# Altium project Cellar Watchdog.PrjPcb (part 3 of 4)

## Sheet Battery Charger.SchDoc: Battery Charger & Port
size A4; Date: Dec. 27th, 2022; Author: Karl Asseily; DrawnBy: Karl Asseily; DocumentNumber: 202301151822; Revision: 1.2; SheetNumber: 7; SheetTotal: 20
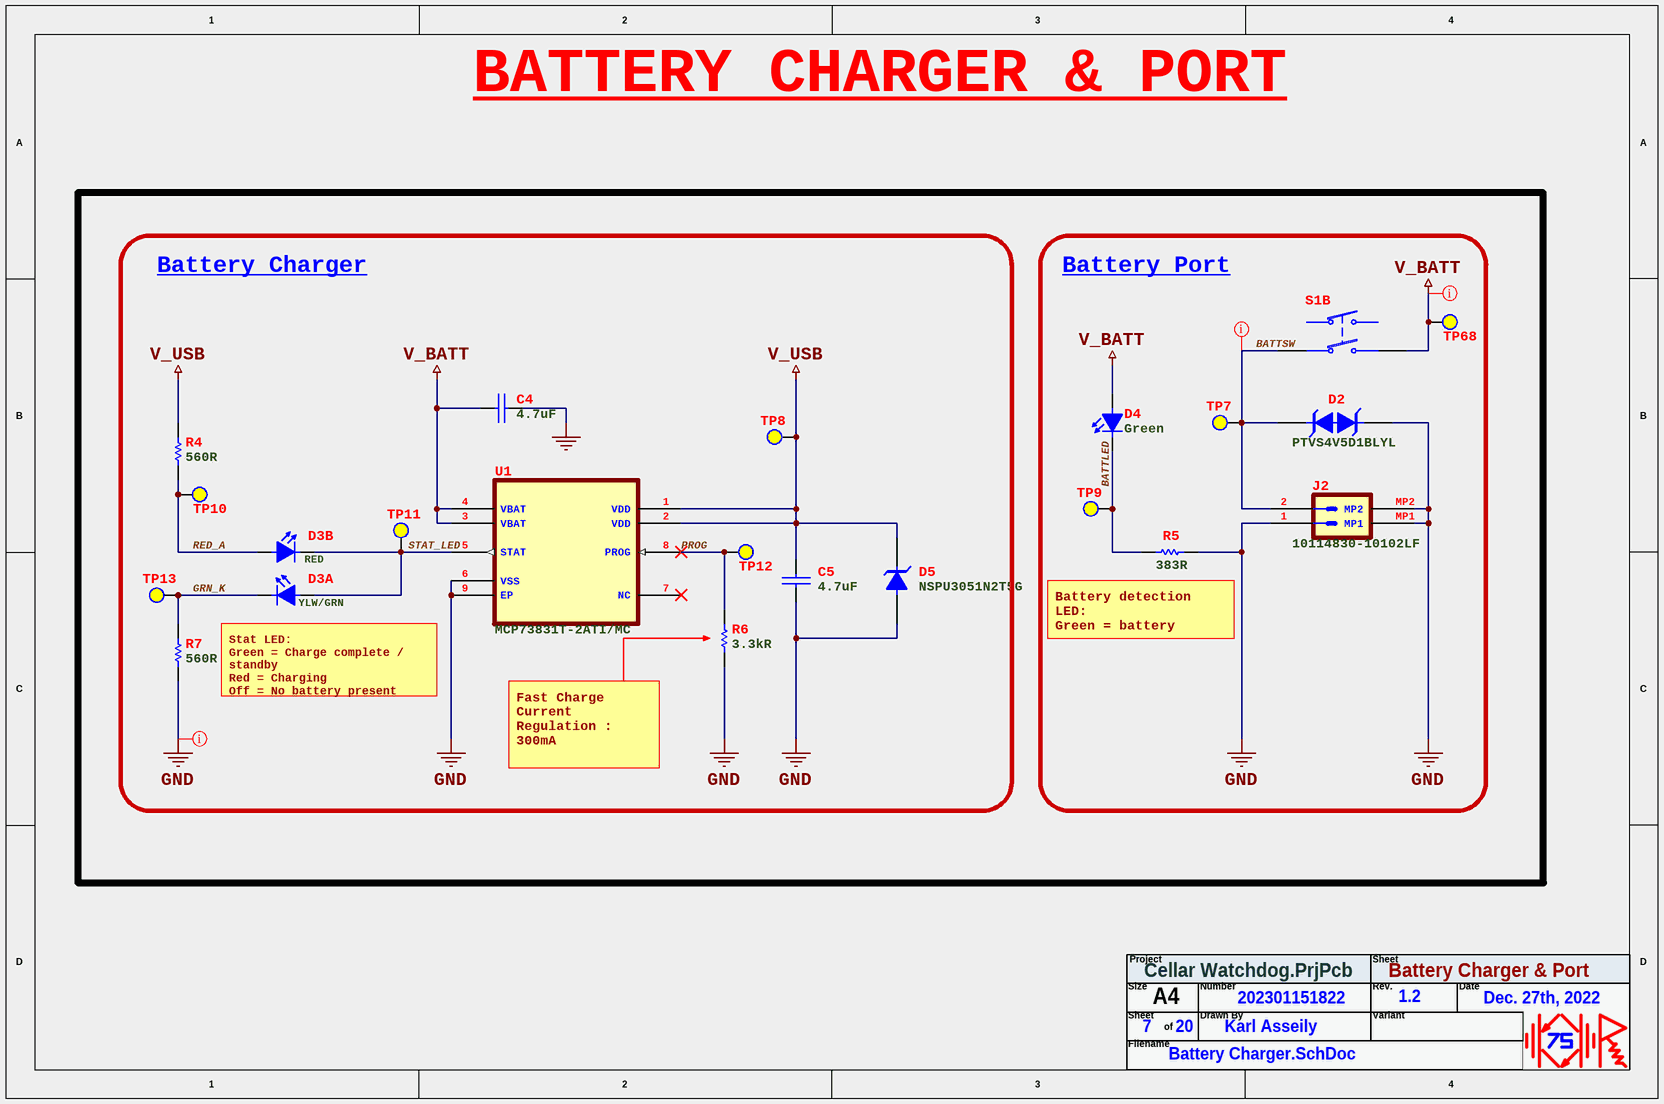
[diagram p14: Battery Charger.SchDoc]

### Parts
C4  4.7uF  [CAP_0805]
C5  4.7uF  [CAP_0805]
D2  PTVS4V5D1BLYL  [DIO-T_DFN1006-2]
D3  Green,Red  [LED_5988510207F]  (value not drawn)  (parts A,B of 2)
D4  Green  [LED_GRN_0603]
D5  NSPU3051N2T5G  [DIO-T_DFN1006-2]
J2  10114830-10102LF  [CON-PLG_HDR_2X1-10114828-11103LF]
R4  560R  [RES_0603]
R5  383R  [RES_0603]
R6  3.3kR  [RES_0603]
R7  560R  [RES_0603]
S1  R1973BBLKBLKGR0  [SW_ROCKER-DPST_R1973BBLKBLKGR0]  (value not drawn)  (part B of 2)
TP7  BATTSW  [TEST POINT PAD]  (value not drawn)  (no BOM)
TP8  V_USB  [TEST POINT HOLE]  (value not drawn)  (no BOM)
TP9  BATTLED  [TEST POINT HOLE]  (value not drawn)  (no BOM)
TP10  RED_A  [TEST POINT HOLE]  (value not drawn)  (no BOM)
TP11  STAT_LED  [TEST POINT HOLE]  (value not drawn)  (no BOM)
TP12  PROG  [TEST POINT HOLE]  (value not drawn)  (no BOM)
TP13  GRN_K  [TEST POINT HOLE]  (value not drawn)  (no BOM)
TP68  V_BATT  [TEST POINT PAD]  (value not drawn)  (no BOM)
U1  MCP73831T-2ATI/MC  [IC_SON50P200X300X100-9N]

### Blocks framed on the sheet
Battery Charger: C4 C5 D3 D5 R4 R6 R7 TP8 TP10-TP13 U1
Battery Port: D2 D4 J2 R5 S1 TP7 TP9 TP68

### Nets
GND: C4.2 C5.2 D2.2(K2) D5.2(A) J2.1 J2.MP1 J2.MP2 R5.2 R6.2 R7.2 U1.6(VSS) U1.9(EP)
V_BATT: C4.1 D4.1(A) S1.2a TP68.TP U1.3(VBAT) U1.4(VBAT)
V_USB: C5.1 D5.1(K) R4.2 TP8.TP U1.1(VDD) U1.2(VDD)
BATTLED: D4.2(K) R5.1 TP9.TP
BATTSW: D2.1(K1) J2.2 S1.2 TP7.TP
GRN_K: D3.2(K) R7.1 TP13.TP
PROG: R6.1 TP12.TP U1.8(PROG)
RED_A: D3.3(A) R4.1 TP10.TP
STAT_LED: D3.1(A) D3.4(K) TP11.TP U1.5(STAT)

Not connected (* = marked no-connect by the designer): U1 7(NC)*

### Layout directives
net class POWER; rule Supply Nets [Voltage = 0.000]: GND
net class POWER; rule Supply Nets [Voltage = 3.700]: BATTSW, V_BATT

### Notes on the sheet
- BATTERY CHARGER & PORT
- (near D3) RED
- (near D3) YLW/GRN
- Stat LED:
  Green = Charge complete / standby
  Red = Charging
  Off = No battery present
- (near R5) Battery detection LED:
  Green = battery present
  Off = no battery
- Fast Charge Current Regulation : 300mA
  Use 2kR RES to set charge at 500mA.
- Project
- Sheet
- Size
- Filename
- A4
- of
- Number
- Drawn By
- Rev.
- Variant
- Date

### Library data of the parts
C4 C5 = CAP_4.7uF-25V-10%_0805: 4.7 µF ±10% 25V Ceramic Capacitor X7R 0805 (2012 Metric); Manufacturer: Yageo; Manufacturer Part Number: CC0805KKX7R8BB475; Supplier 1: Digi-Key; RoHS: Yes; Category: Ceramic Capacitors; Stock 1: 26099; Pricing 1: 1=0.39000, 10=0.27000, 50=0.18940, 100=0.16230, 500=0.12172, 1000=0.10278 (USD); Mounting Technology: Surface Mount; Case/Package: 0805; Case Code (Metric): 2012; Case Code (Imperial): 0805; Weight: 0.000194oz; Min Operating Temperature: -55°C; Max Operating Temperature: 125°C; Packaging: Tape and Reel; Capacitance: 4.7uF; Voltage Rating: 25V; Tolerance: 10%; Dielectric: X7R; Termination: SMD/SMT; Voltage Rating (DC): 25V; Package Quantity: 3000; Length: 0.079inch; Width: 0.049inch; Thickness: 0.057inch; Lead Free: Lead Free; Halogen Free: Halogen Free; RoHS Compliant: Yes; ComponentLink1URL: C:\Users\Public\Documents\Altium\Projects\Cellar_Watchdog\Docs\Capacitor\UPY-GP_NP0_16V-to-50V_18.pdf; ComponentLink1Description: Datasheet; Supplier 2: Mouser; Supplier Part Number 1: 311-1885-1-ND; Supplier Part Number 2: 603-CC805KKX7R8BB475
D2 = DIO-T-BI_4.7V-13.2V-34A_DFN1006-2: 13.2V Clamp 34A (8/20µs) Ipp Tvs Diode Surface Mount DFN1006-2; Manufacturer: Nexperia; Supplier 1: Digi-Key; Manufacturer Part Number: PTVS4V5D1BLYL; RoHS: Yes; Category: TVS Diodes; Stock 1: 9587; Pricing 1: 1=0.30000, 10=0.24200, 100=0.12810, 500=0.08426, 1000=0.05730, 2000=0.05168, 5000=0.04494 (USD); RoHS Compliant: Yes; ComponentLink1URL: C:\Users\Public\Documents\Altium\Projects\Cellar_Watchdog\Docs\Diode\PTVS4V5D1BL.pdf; ComponentLink1Description: Datasheet; Supplier 2: Mouser; Supplier Part Number 1: 1727-7415-1-ND; Supplier Part Number 2: 771-PTVS4V5D1BLYL
D3 = LED_RED-YG-2V-20mA_2-SMD: Green, Red 565nm Green, 635nm Red LED Indication - Discrete 2V Green, 2V Red 2-SMD, No Lead; Manufacturer: Dialight; Manufacturer Part Number: 5988510207F; Lens Color: Colorless,Clear; Luminous Intensity: 60mcd; Forward Current: 20mA; Viewing Angle: 160°; Forward Voltage: 1.8V; Lens Style: Domed,Round,Diffused,Colorless,Clear; Lens Transparency: Clear; Number of Elements: 2; Power Dissipation: 48mW; Reverse Voltage: 5V; Lens Size: 1mm; Supplier 1: Digi-Key; RoHS: Yes; Category: LEDs; Stock 1: 52868; Pricing 1: 1=0.54000, 10=0.33400, 100=0.19190, 1000=0.15017 (USD); Mounting Technology: Surface Mount; Case/Package: SMD/SMT; Pins: 4; Color: Green,Red; Min Operating Temperature: -40°C; Max Operating Temperature: 100°C; Packaging: Tape and Reel; Package Quantity: 3000; Series: 598; Illumination Color: Green,Red; Test Current: 20mA; Dominant Wavelength: 635nm; Wavelength: 635nm; Number of LEDs: 2; Length: 1mm; Width: 1.5mm; Height: 1mm; Depth: 3.2mm; Radiation Hardening: No; Reach SVHC Compliant: Yes; RoHS Compliant: Yes; Lead Free: Lead Free; ComponentLink1URL: C:\Users\Public\Documents\Altium\Projects\Cellar_Watchdog\Docs\LED\Dialight_CBI_data_598-biRA_Apr2018.pdf; ComponentLink1Description: Datasheet; Supplier 2: Mouser; Supplier Part Number 1: 350-2072-1-ND; Supplier Part Number 2: 645-598-8510-207F
D4 = LED_GRN-2.1V-30mA_0603: Green 571nm LED Indication - Discrete 2V 0603 (1608 Metric); Manufacturer: Vishay Lite-On; Manufacturer Part Number: LTST-C191KGKT; Lens Color: Colorless; Luminous Intensity: 35mcd; Viewing Angle: 130°; Test Current: 20mA; Lens Transparency: Clear; Wavelength: 574nm; Lens Style: Rectangular,Colorless; Forward Current: 30mA; Number of Elements: 1; Power Dissipation: 75mW; Reverse Voltage: 5V; Supplier 1: Digi-Key; RoHS: Yes; Category: Uncategorized; Stock 1: 3090195; Pricing 1: 1=0.26000, 10=0.14100, 100=0.06560, 500=0.06060, 1000=0.04747, 2000=0.04646 (USD); Mounting Technology: Surface Mount; Case/Package: 0603; Pins: 2; Color: Green; Case Code (Metric): 1608; Case Code (Imperial): 0603; Min Operating Temperature: -55°C; Max Operating Temperature: 85°C; Packaging: Tape and Reel; Package Quantity: 1; Forward Voltage: 2V; Dominant Wavelength: 571nm; Illumination Color: Green; Number of LEDs: 1; Power Rating: 75mW; Max Power Dissipation: 75mW; Length: 1.6mm; Width: 0.8mm; Height: 0.55mm; Depth: 0.8mm; Radiation Hardening: No; RoHS Compliant: Yes; Lead Free: Lead Free; ComponentLink1URL: C:\Users\Public\Documents\Altium\Projects\Cellar_Watchdog\Docs\LED\LTST-C191KSKT.PDF; ComponentLink1Description: Datasheet; Supplier 2: Mouser; Supplier Part Number 2: 859-LTST-C191KGKT; Supplier Part Number 1: 160-1446-6-ND
D5 = DIO-T-UNI_5.7V-9.5V-36A_DFN1006-2: 9.5V Clamp 36A (8/20µs) Ipp Tvs Diode Surface Mount 2-X2DFN (1x0.6); Manufacturer: ON Semiconductor; Number of Unidirectional Channels: 1; Reverse Standoff Voltage: 5.5V; Min Breakdown Voltage: 5.7V; Power Line Protection: No; Supplier 1: Digi-Key; Manufacturer Part Number: NSPU3051N2T5G; RoHS: Yes; Category: ESD and Circuit Protection ICs; Stock 1: 11788; Pricing 1: 1=0.40000, 10=0.30000, 100=0.17000, 500=0.11258, 1000=0.08631, 2000=0.07505 (USD); Mounting Technology: Surface Mount; Pins: 2; Min Operating Temperature: -65°C; Max Operating Temperature: 150°C; Resistor Type: Zener; Packaging: Cut Tape; Clamping Voltage: 9.5V; Peak Pulse Current: 36A; RoHS Compliant: Yes; ComponentLink1URL: C:\Users\Public\Documents\Altium\Projects\Cellar_Watchdog\Docs\Diode\NSPU3051-D.PDF; ComponentLink1Description: Datasheet; Supplier 2: Mouser; Supplier Part Number 1: NSPU3051N2T5GOSCT-ND; Supplier Part Number 2: 863-NSPU3051N2T5G
J2 = CON-PLG_HDR_2X1-49-RA-SMD: Connector Header Surface Mount, Right Angle 2 position 0.049" (1.25mm); Manufacturer: Amphenol Communications Solutions; Supplier 1: Digi-Key; Manufacturer Part Number: 10114830-10102LF; RoHS: No; Category: Connectors; Stock 1: 12004; Pricing 1: 1=0.39000, 10=0.33200, 100=0.25860, 500=0.22164 (USD); Supplier 2: Mouser; Supplier Part Number 1: 609-5378-1-ND; Supplier Part Number 2: 649-10114830-10102LF; ComponentLink1Description: Datasheet; ComponentLink1URL: C:\Users\Public\Documents\Altium\Projects\Cellar_Watchdog\Docs\Connector\gs-12-675.pdf; ComponentLink2Description: Drawing; ComponentLink2URL: C:\Users\Public\Documents\Altium\Projects\Cellar_Watchdog\Docs\Connector\10114830.pdf
R4 R7 = RES_560R-100mW-1%_0603: 560 Ohms ±1% 0.1W, 1/10W Chip Resistor 0603 (1608 Metric) Moisture Resistant Thick Film; Manufacturer: Yageo; Manufacturer Part Number: RC0603FR-07560RL; Voltage Rating (DC): 50V; Temperature Coefficient: 100ppm/°C; Power Rating: 100mW; Voltage Rating: 75V; Supplier 1: Digi-Key; RoHS: Yes; Category: Chip SMD Resistors; Stock 1: 1325599; Pricing 1: 1=0.10000, 10=0.02100, 100=0.00850, 1000=0.00383, 2500=0.00332 (USD); Case/Package: 0603; Pins: 2; Case Code (Imperial): 0603; Case Code (Metric): 1608; Weight: 7.1E-05oz; Min Operating Temperature: -55°C; Max Operating Temperature: 155°C; Packaging: Tape and Reel; Resistance: 560R; Tolerance: 1%; Resistor Type: Thick Film; Package Quantity: 1; Termination: SMD/SMT; Number of Terminations: 2; Max Power Dissipation: 100mW; Working Voltage: 75V; Features: Moisture Resistant; Series: RC; Construction: Rectangular; Resistance Tolerance: 1%; Technology: THICK FILM; Length: 1.6mm; Width: 0.8mm; Height: 0.45mm; Depth: 0.8mm; Reach SVHC Compliant: Yes; Lead Free: Lead Free; Military Standard: Not; RoHS Compliant: Yes; ComponentLink1URL: C:\Users\Public\Documents\Altium\Projects\Cellar_Watchdog\Docs\Resistor\PYu-RC_Group_51_RoHS_L_12.pdf; ComponentLink1Description: Datasheet; Supplier 2: Mouser; Supplier Part Number 2: 603-RC0603FR-07560RL; Supplier Part Number 1: 311-560HRCT-ND
R5 = RES_383R-100mW-1%_0603: 383 Ohms ±1% 0.1W, 1/10W Chip Resistor 0603 (1608 Metric) Moisture Resistant Thick Film; Manufacturer: Yageo; Manufacturer Part Number: RC0603FR-07383RL; Power Rating: 100mW; Voltage Rating: 50V; Temperature Coefficient: 100ppm/°C; Supplier 1: Digi-Key; RoHS: Yes; Category: Chip SMD Resistors; Stock 1: 398710; Pricing 1: 1=0.10000, 10=0.02100, 100=0.00850, 1000=0.00383, 2500=0.00332 (USD); Case/Package: 0603; Case Code (Imperial): 0603; Case Code (Metric): 1608; Min Operating Temperature: -55°C; Max Operating Temperature: 155°C; Packaging: Tape and Reel; Resistance: 383R; Tolerance: 1%; Package Quantity: 1; Termination: SMD/SMT; Resistor Type: Thick Film; Number of Terminations: 2; Max Power Dissipation: 100mW; Voltage Rating (DC): 50V; Features: Moisture Resistant; Series: RC; Construction: Rectangular; Length: 1.6mm; Width: 0.8mm; Height: 0.022inch; Depth: 0.8mm; Military Standard: Not; Lead Free: Lead Free; RoHS Compliant: Yes; ComponentLink1URL: C:\Users\Public\Documents\Altium\Projects\Cellar_Watchdog\Docs\Resistor\PYu-RC_Group_51_RoHS_L_12.pdf; ComponentLink1Description: Datasheet; Supplier 2: Mouser; Supplier Part Number 2: 603-RC0603FR-07383RL; Supplier Part Number 1: 311-383HRCT-ND
R6 = RES_3.3kR-100mW-1%_0603: 3.3 kOhms ±1% 0.1W, 1/10W Chip Resistor 0603 (1608 Metric) Moisture Resistant Thick Film; Manufacturer: Yageo; Manufacturer Part Number: RC0603FR-073K3L; Temperature Coefficient: 100ppm/°C; Voltage Rating (DC): 50V; Power Rating: 100mW; Supplier 1: Digi-Key; RoHS: Yes; Category: Chip SMD Resistors; Stock 1: 3083433; Pricing 1: 1=0.10000, 10=0.02100, 100=0.00850, 1000=0.00383, 2500=0.00332 (USD); Case/Package: 0603; Pins: 2; Case Code (Imperial): 0603; Case Code (Metric): 1608; Min Operating Temperature: -55°C; Max Operating Temperature: 155°C; Resistance: 3.3kR; Tolerance: 1%; Packaging: Tape and Reel; Resistor Type: Thick Film; Voltage Rating: 50V; Package Quantity: 1; Termination: SMD/SMT; Number of Terminations: 2; Max Power Dissipation: 100mW; Features: Moisture Resistant; Series: RC; Resistance Tolerance: 1%; Construction: Rectangular; Length: 1.6mm; Width: 0.8mm; Height: 0.022inch; Depth: 0.8mm; Reach SVHC Compliant: Yes; Lead Free: Lead Free; Military Standard: Not; RoHS Compliant: Yes; Supplier 2: Mouser; ComponentLink1Description: Datasheet; ComponentLink1URL: C:\Users\Public\Documents\Altium\Projects\Cellar_Watchdog\Docs\Resistor\PYu-RC_Group_51_RoHS_L_12.pdf; Supplier Part Number 2: 603-RC0603FR-073K3L; Supplier Part Number 1: 311-3.30KHRCT-ND
S1 = SW4-ON-OFF-DPST_R1973BBLKBLKGR0_TH: Rocker Switch DPST 9A (AC) 125 V Panel Mount, Snap-In, Right Angle; Manufacturer: E-Switch; Mechanical Life: 30000Cycles; Voltage Rating (AC): 125V; Electrical Life: 10000Cycles; Switch Function: On-Off; Illumination Type: Illuminated; Supplier 1: Digi-Key; Manufacturer Part Number: R1973BBLKBLKGR0; RoHS: No; Category: Rocker Switches; Stock 1: 214; Pricing 1: 1=3.07000, 10=2.75300, 25=2.60040, 50=2.48640, 100=2.35950, 250=2.25804, 500=2.08044, 1000=1.97895 (USD); Mounting Technology: Panel,Snap in; Contact Plating: Silver; Min Operating Temperature: -30°C; Max Operating Temperature: 55°C; Package Quantity: 1; Current Rating: 9A; Packaging: Bulk; Termination: PC Pin; Throw Configuration: DPST; Series: R1973; Actuator Type: Rocker; RoHS Compliant: No; ComponentLink1URL: C:\Users\Public\Documents\Altium\Projects\Cellar_Watchdog\Docs\Switch\R1973.pdf; ComponentLink1Description: Datasheet; ComponentLink2Description: Drawing; ComponentLink2URL: C:\Users\Public\Documents\Altium\Projects\Cellar_Watchdog\Docs\Switch\M400001.pdf; Supplier Part Number 1: R1973BBLKBLKGR0-ND
TP7-TP13 TP68 = Test Point: PCB Test Point; ClassName: Test Point
  TP7: Value: BATTSW
  TP8: Value: V_USB
  TP9: Value: BATTLED
  TP10: Value: RED_A
  TP11: Value: STAT_LED
  TP12: Value: PROG
  TP13: Value: GRN_K
  TP68: Value: V_BATT
U1 = IC_MCP73831T-2ATI/MC: Charger IC Lithium Ion/Polymer 8-DFN (2x3); Manufacturer: Microchip; Min Supply Voltage: 3.75V; Max Supply Voltage: 6V; Output Current: 500mA; Output Voltage: 4.2V; Supplier 1: Digi-Key; Manufacturer Part Number: MCP73831T-2ATI/MC; RoHS: Yes; Category: Battery Management; Stock 1: 3592; Pricing 1: 1=0.80000, 25=0.73520 (USD); Mount: Surface Mount; Case/Package: DFN; Number of Pins: 8; Min Operating Temperature: -40°C; Max Operating Temperature: 85°C; Packaging: Tape and Reel; Package Quantity: 3300; Radiation Hardening: No; Lead Free: Contains Lead; RoHS Compliant: Yes; Supplier 2: Mouser; Supplier Part Number 1: MCP73831T-2ATI/MCCT-ND; Supplier Part Number 2: 579-MCP73831T-2ATIMC; ComponentLink2Description: Datasheet; ComponentLink2URL: C:\Users\Public\Documents\Altium\Projects\Cellar_Watchdog\Docs\Battery Charger\MCP73831-Family-Data-Sheet-DS20001984H.pdf

## Sheet LCD Display.SchDoc: LCD Display
size A4; Date: Dec. 29th, 2022; Author: Karl Asseily; DrawnBy: Karl Asseily; DocumentNumber: 202301140903; Revision: 1.2; SheetNumber: 18; SheetTotal: 20; Time: 23:00
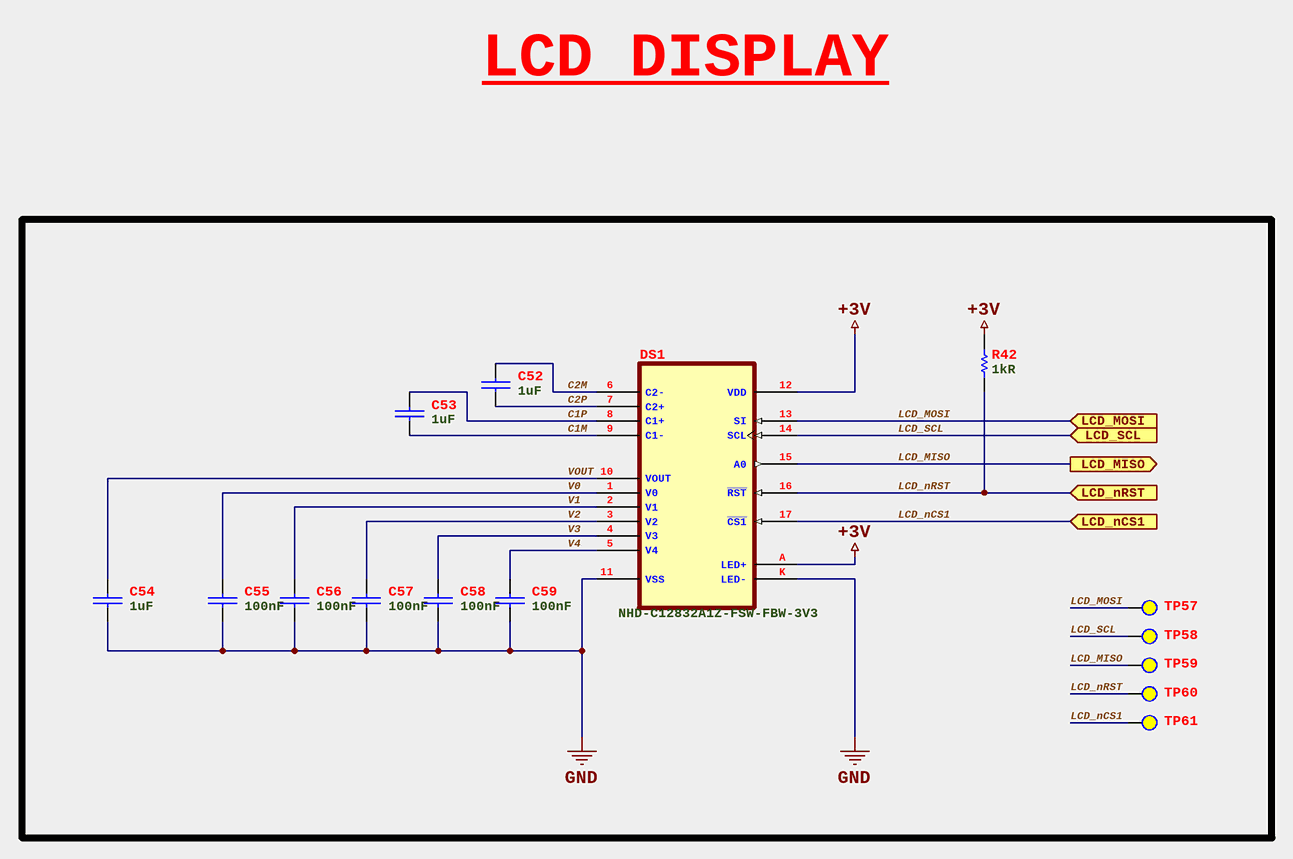
[diagram p15: LCD Display.SchDoc]

### Parts
C52  1uF  [CAP_0805]
C53  1uF  [CAP_0805]
C54  1uF  [CAP_0805]
C55  100nF  [CAP_0603]
C56  100nF  [CAP_0603]
C57  100nF  [CAP_0603]
C58  100nF  [CAP_0603]
C59  100nF  [CAP_0603]
DS1  NHD-C12832A1Z-FSW-FBW-3V3  [LCD_NHD-C12832A1Z-FSW-FBW-3V3]
R42  1kR  [RES_0603]
TP57  LCD_MOSI  [TEST POINT PAD]  (value not drawn)  (no BOM)
TP58  LCD_SCL  [TEST POINT PAD]  (value not drawn)  (no BOM)
TP59  LCD_MISO  [TEST POINT PAD]  (value not drawn)  (no BOM)
TP60  LCD_nRST  [TEST POINT PAD]  (value not drawn)  (no BOM)
TP61  LCD_nCS1  [TEST POINT PAD]  (value not drawn)  (no BOM)

### Ports
LCD_MISO (out, see Cellar Watchdog, ESP32 Processor, Main Controller Unit), LCD_MOSI (in, see Cellar Watchdog, ESP32 Processor, Main Controller Unit), LCD_nCS1 (in, see Cellar Watchdog, ESP32 Processor, Main Controller Unit), LCD_nRST (in, see Cellar Watchdog, ESP32 Processor, Main Controller Unit), LCD_SCL (in, see Cellar Watchdog, ESP32 Processor, Main Controller Unit)

### Nets
+3V: DS1.12(VDD) DS1.A(LED+) R42.2
GND: C54.2 C55.2 C56.2 C57.2 C58.2 C59.2 DS1.11(VSS) DS1.K(LED-)
C1M: C53.2 DS1.9(C1-)
C1P: C53.1 DS1.8(C1+)
C2M: C52.1 DS1.6(C2-)
C2P: C52.2 DS1.7(C2+)
LCD_MISO: DS1.15(A0) TP59.TP ; port LCD_MISO
LCD_MOSI: DS1.13(SI) TP57.TP ; port LCD_MOSI
LCD_nCS1: DS1.17(~{CS1}) TP61.TP ; port LCD_nCS1
LCD_nRST: DS1.16(~{RST}) R42.1 TP60.TP ; port LCD_nRST
LCD_SCL: DS1.14(SCL) TP58.TP ; port LCD_SCL
V0: C55.1 DS1.1(V0)
V1: C56.1 DS1.2(V1)
V2: C57.1 DS1.3(V2)
V3: C58.1 DS1.4(V3)
V4: C59.1 DS1.5(V4)
VOUT: C54.1 DS1.10(VOUT)

### Notes on the sheet
- LCD DISPLAY
- Project
- Sheet
- Size
- Filename
- A4
- of
- Number
- Drawn By
- Rev.
- Variant
- Date

### Library data of the parts
C52-C54 = CAP_1uF-16V-10%_0603: 1 µF ±10% 16V Ceramic Capacitor X7R 0603 (1608 Metric); Manufacturer: Yageo; Manufacturer Part Number: CC0603KRX7R7BB105; Dissipation Factor: 5%; Supplier 1: Digi-Key; RoHS: Yes; Category: Ceramic Capacitors; Stock 1: 10491943; Pricing 1: 1=0.14000, 10=0.09800, 50=0.05560, 100=0.04610, 500=0.03234, 1000=0.02678 (USD); Mounting Technology: Surface Mount; Case/Package: 0603; Pins: 2; Case Code (Metric): 1608; Case Code (Imperial): 0603; Min Operating Temperature: -55°C; Max Operating Temperature: 125°C; Capacitance: 1uF; Tolerance: 10%; Dielectric: X7R; Voltage Rating: 16V; Package Quantity: 1; Packaging: Tape and Reel; Voltage Rating (DC): 16V; Termination: SMD/SMT; Resistor Type: Ceramic; Voltage: 16V; Series: CC; Construction: Flat; Length: 1.6mm; Width: 0.031inch; Height: 0.8mm; Thickness: 0.035inch; Depth: 0.8mm; Radiation Hardening: No; Lead Free: Lead Free; Halogen Free: Halogen Free; RoHS Compliant: Yes; ComponentLink1URL: C:\Users\Public\Documents\Altium\Projects\Cellar_Watchdog\Docs\Capacitor\UPY-GPHC_X7R_6.3V-to-250V_22.pdf; ComponentLink1Description: Datasheet; Supplier 2: Mouser; Supplier Part Number 1: 311-1446-1-ND; Supplier Part Number 2: 603-CC603KRX7R7BB105
C55-C59 = CAP_0.1uF-50V-10%_0603: 0.1 µF ±10% 50V Ceramic Capacitor X7R 0603 (1608 Metric); Manufacturer: Yageo; Manufacturer Part Number: CC0603KRX7R9BB104; Supplier 1: Digi-Key; RoHS: Yes; Category: Ceramic Capacitors; Stock 1: 10054527; Pricing 1: 1=0.10000, 10=0.05400, 50=0.02960, 100=0.02430, 500=0.01732, 1000=0.01361 (USD); Mounting Technology: Surface Mount; Case/Package: 0603; Pins: 2; Case Code (Metric): 1608; Case Code (Imperial): 0603; Dielectric Material: Ceramic; Min Operating Temperature: -55°C; Max Operating Temperature: 125°C; Package Quantity: 1; Capacitance: 100nF; Voltage Rating: 50V; Tolerance: 10%; Packaging: Tape and Reel; Dielectric: X7R; Termination: SMD/SMT; Voltage: 50V; Series: CC; Length: 0.063inch; Width: 0.031inch; Height: 0.8mm; Thickness: 0.035inch; Depth: 0.8mm; Radiation Hardening: No; Reach SVHC Compliant: Yes; Lead Free: Lead Free; Halogen Free: Halogen Free; RoHS Compliant: Yes; ComponentLink1URL: C:\Users\Public\Documents\Altium\Projects\Cellar_Watchdog\Docs\Capacitor\UPY-GPHC_X7R_6.3V-to-250V_22.pdf; ComponentLink1Description: Datasheet; Supplier Part Number 2: 603-CC603KRX7R9BB104; Supplier Part Number 1: 311-1344-1-ND; Supplier 2: Mouser
DS1 = LCD_NHD-C12832A1Z-FSW-FBW-3V3: Graphic LCD Display Module Transflective Black (White - Inverted) FSTN - Film Super-Twisted Nematic SPI 128 x 32; Manufacturer: Newhaven Display; Contrast Ratio: 6:1; Backlight Type: LED; Touchscreen: No; Resolution (height): 32pixel; Resolution (width): 128pixel; Supplier 1: Digi-Key; Manufacturer Part Number: NHD-C12832A1Z-FSW-FBW-3V3; RoHS: Yes; Category: LCD, OLED, Graphic Displays; Stock 1: 5801; Pricing 1: 1=12.78000, 5=12.01600, 10=11.24800, 50=10.60900, 100=10.09780, 250=9.58656, 500=9.20310 (USD); Mount: Through Hole; Number of Pins: 17; Min Operating Temperature: -20°C; Max Operating Temperature: 70°C; Background Color: Black; Packaging: Bulk; Package Quantity: 100; Interface: SPI; Supplier 2: Mouser; Supplier Part Number 2: 763-C12832A1ZFSWFBW3; Supplier Part Number 1: NHD-C12832A1Z-FSW-FBW-3V3-ND; ComponentLink2Description: Datasheet; ComponentLink2URL: C:\Users\Public\Documents\Altium\Projects\Cellar_Watchdog\Docs\LCD Display\NHD-C12832A1Z-FSW-FBW-3V3.pdf; ComponentLink3Description: Controller Datasheet; ComponentLink3URL: C:\Users\Public\Documents\Altium\Projects\Cellar_Watchdog\Docs\LCD Display\ST7565R.pdf
R42 = RES_1kR-100mW-1%_0603: 1 kOhms ±1% 0.1W, 1/10W Chip Resistor 0603 (1608 Metric) Moisture Resistant Thick Film; Manufacturer: Yageo; Manufacturer Part Number: RC0603FR-071KL; Temperature Coefficient: 100ppm/°C; Power Rating: 100mW; Voltage Rating: 50V; Supplier 1: Digi-Key; RoHS: Yes; Category: Chip SMD Resistors; Stock 1: 31324809; Pricing 1: 1=0.10000, 10=0.02100, 100=0.00850, 1000=0.00383, 2500=0.00332 (USD); Case/Package: 0603; Contact Plating: Tin,Matte; Case Code (Imperial): 0603; Case Code (Metric): 1608; Min Operating Temperature: -55°C; Max Operating Temperature: 155°C; Tolerance: 1%; Resistance: 1kR; Resistor Type: Thick Film; Packaging: Tape and Reel; Termination: SMD/SMT; Features: Moisture Resistant; Series: RC; Max Power Dissipation: 100mW; Number of Terminations: 2; Technology: THICK FILM; Resistance Tolerance: 1%; Construction: Rectangular; Length: 1.6mm; Height: 0.45mm; Depth: 0.8mm; Radiation Hardening: No; Reach SVHC Compliant: Yes; Lead Free: Lead Free; Military Standard: Not; RoHS Compliant: Yes; Supplier 2: Mouser; Supplier Part Number 2: 603-RC0603FR-071KL; Supplier Part Number 1: 311-1.00KHRCT-ND; ComponentLink1Description: Datasheet; ComponentLink1URL: C:\Users\Public\Documents\Altium\Projects\Cellar_Watchdog\Docs\Resistor\PYu-RC_Group_51_RoHS_L_12.pdf
TP57-TP61 = Test Point: PCB Test Point; ClassName: Test Point
  TP57: Value: LCD_MOSI
  TP58: Value: LCD_SCL
  TP59: Value: LCD_MISO
  TP60: Value: LCD_nRST
  TP61: Value: LCD_nCS1

## Sheet Light and Proximity Sensor.SchDoc: Ambient Light & Proximity Sensor
size A4; Date: Dec. 27th, 2022; Author: Karl Asseily; DrawnBy: Karl Asseily; DocumentNumber: 202301140903; Revision: 1.2; SheetNumber: 19; SheetTotal: 20
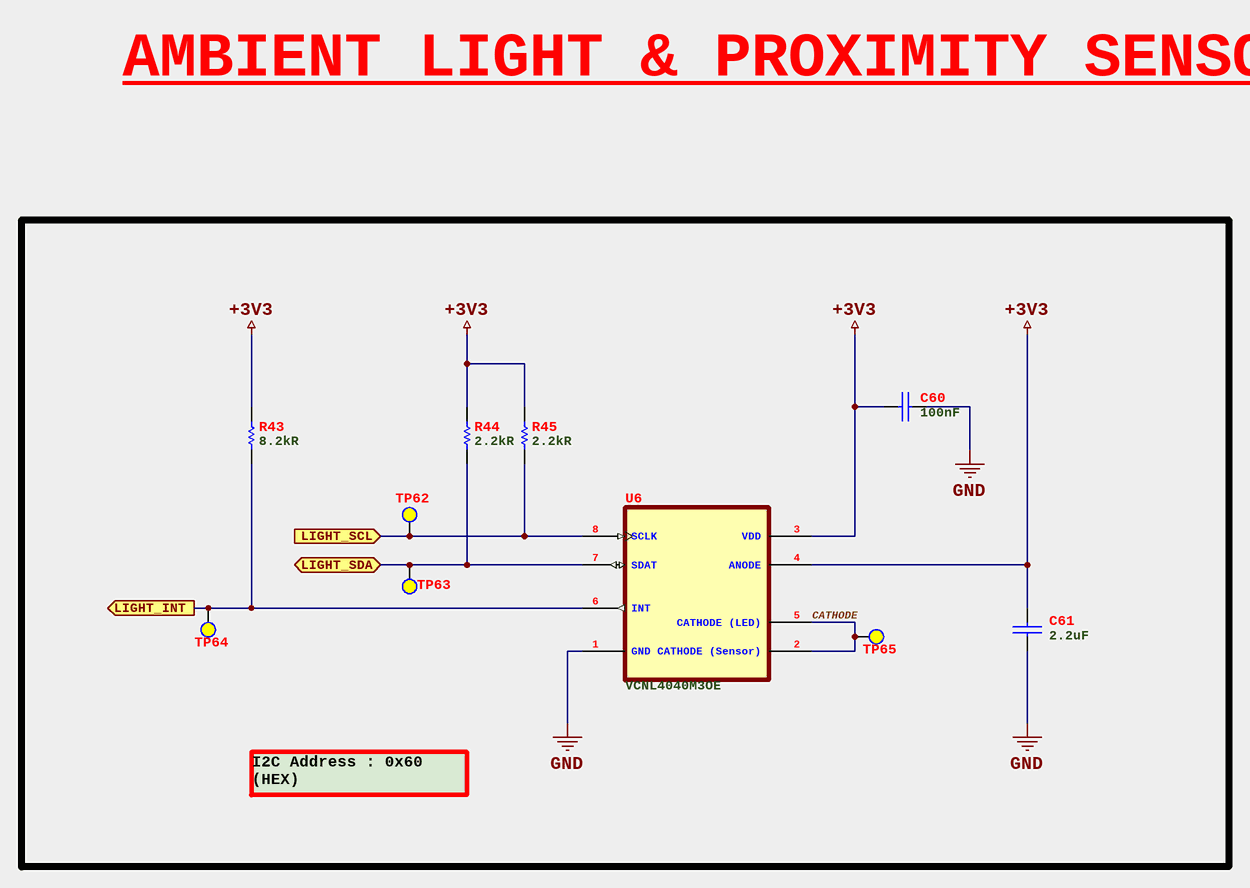
[diagram p16: Light and Proximity Sensor.SchDoc]

### Parts
C60  100nF  [CAP_0603]
C61  2.2uF  [CAP_0805]
R43  8.2kR  [RES_0603]
R44  2.2kR  [RES_0603]
R45  2.2kR  [RES_0603]
TP62  LIGHT_SCL  [TEST POINT PAD]  (value not drawn)  (no BOM)
TP63  LIGHT_SDA  [TEST POINT PAD]  (value not drawn)  (no BOM)
TP64  LIGHT_INT  [TEST POINT PAD]  (value not drawn)  (no BOM)
TP65  CATHODE  [TEST POINT PAD]  (value not drawn)  (no BOM)
U6  VCNL4040M3OE  [IC_VISHAY_VCNL4040_4X2X1.1]

### Ports
LIGHT_INT (out, see Cellar Watchdog, ESP32 Processor, Main Controller Unit), LIGHT_SCL (in, see Cellar Watchdog, ESP32 Processor, Main Controller Unit), LIGHT_SDA (bidir, see Cellar Watchdog, ESP32 Processor, Main Controller Unit)

### Nets
+3V3: C60.1 C61.1 R43.2 R44.2 R45.2 U6.3(VDD) U6.4(ANODE)
GND: C60.2 C61.2 U6.1(GND)
CATHODE: TP65.TP U6.2(CATHODE_(Sensor)) U6.5(CATHODE_(LED))
LIGHT_INT: R43.1 TP64.TP U6.6(INT) ; port LIGHT_INT
LIGHT_SCL: R45.1 TP62.TP U6.8(SCLK) ; port LIGHT_SCL
LIGHT_SDA: R44.1 TP63.TP U6.7(SDAT) ; port LIGHT_SDA

### Notes on the sheet
- AMBIENT LIGHT & PROXIMITY SENSOR
- I2C Address : 0x60 (HEX)
  0110 0000
- Project
- Sheet
- Size
- Filename
- A4
- of
- Number
- Drawn By
- Rev.
- Variant
- Date

### Library data of the parts
C60 = CAP_0.1uF-50V-10%_0603: as C55-C59 on sheet LCD Display; Supplier 1: Digi-Key; RoHS: Yes; Category: Ceramic Capacitors; Stock 1: 10054527; Pricing 1: 1=0.10000, 10=0.05400, 50=0.02960, 100=0.02430, 500=0.01732, 1000=0.01361 (USD); Mounting Technology: Surface Mount; Case/Package: 0603; Pins: 2; Case Code (Metric): 1608; Case Code (Imperial): 0603; Dielectric Material: Ceramic; Min Operating Temperature: -55°C; Max Operating Temperature: 125°C; Package Quantity: 1; Capacitance: 100nF; Voltage Rating: 50V; Tolerance: 10%; Packaging: Tape and Reel; Dielectric: X7R; Termination: SMD/SMT; Voltage: 50V; Series: CC; Length: 0.063inch; Width: 0.031inch; Height: 0.8mm; Thickness: 0.035inch; Depth: 0.8mm; Radiation Hardening: No; Reach SVHC Compliant: Yes; Lead Free: Lead Free; Halogen Free: Halogen Free; RoHS Compliant: Yes; ComponentLink1URL: C:\Users\Public\Documents\Altium\Projects\Cellar_Watchdog\Docs\Capacitor\UPY-GPHC_X7R_6.3V-to-250V_22.pdf; ComponentLink1Description: Datasheet; Supplier Part Number 2: 603-CC603KRX7R9BB104; Supplier Part Number 1: 311-1344-1-ND; Supplier 2: Mouser
C61 = CAP_2.2uF-16V-10%_0805: 2.2 µF ±10% 16V Ceramic Capacitor X7R 0805 (2012 Metric); Manufacturer: Yageo; Manufacturer Part Number: CC0805KKX7R7BB225; Supplier 1: Digi-Key; RoHS: Yes; Category: Ceramic Capacitors; Stock 1: 121066; Pricing 1: 1=0.27000, 10=0.18700, 50=0.11240, 100=0.09500, 500=0.06500, 1000=0.05749 (USD); Mounting Technology: Surface Mount; Case/Package: 0805; Pins: 2; Case Code (Imperial): 0805; Case Code (Metric): 2012; Min Operating Temperature: -55°C; Max Operating Temperature: 125°C; Capacitance: 2.2uF; Tolerance: 10%; Dielectric: X7R; Voltage Rating: 16V; Voltage Rating (DC): 16V; Packaging: Tape and Reel; Termination: SMD/SMT; Resistor Type: Ceramic; Series: CC; Construction: Flat; Length: 2mm; Width: 0.049inch; Height: 1.25mm; Thickness: 0.057inch; Depth: 1.25mm; Radiation Hardening: No; Lead Free: Lead Free; Halogen Free: Halogen Free; RoHS Compliant: Yes; ComponentLink1URL: C:\Users\Public\Documents\Altium\Projects\Cellar_Watchdog\Docs\Capacitor\UPY-GPHC_X7R_6.3V-to-250V_22.pdf; ComponentLink1Description: Datasheet; Supplier 2: Mouser; Supplier Part Number 2: 603-CC805KKX7R7BB225; Supplier Part Number 1: 311-1881-1-ND
R43 = RES_8.2kR-100mW-1%_0603: 8.2 kOhms ±1% 0.1W, 1/10W Chip Resistor 0603 (1608 Metric) Moisture Resistant Thick Film; Manufacturer: Yageo; Manufacturer Part Number: RC0603FR-078K2L; Voltage Rating (DC): 50V; Temperature Coefficient: 100ppm/°C; Power Rating: 100mW; Supplier 1: Digi-Key; RoHS: Yes; Category: Chip SMD Resistors; Stock 1: 1009120; Pricing 1: 1=0.10000, 10=0.02100, 100=0.00850, 1000=0.00383, 2500=0.00332 (USD); Case/Package: 0603; Pins: 2; Case Code (Metric): 1608; Case Code (Imperial): 0603; Min Operating Temperature: -55°C; Max Operating Temperature: 155°C; Resistance: 8.2kR; Tolerance: 1%; Packaging: Tape and Reel; Resistor Type: Thick Film; Voltage Rating: 50V; Package Quantity: 1; Number of Terminations: 2; Termination: SMD/SMT; Max Power Dissipation: 100mW; Features: Moisture Resistant; Series: RC; Resistance Tolerance: 1%; Technology: THICK FILM; Construction: Rectangular; Length: 0.063inch; Width: 0.031inch; Height: 0.022inch; Depth: 0.8mm; Lead Pitch: 0.3mm; Reach SVHC Compliant: Yes; Lead Free: Lead Free; Military Standard: Not; RoHS Compliant: Yes; ComponentLink1URL: C:\Users\Public\Documents\Altium\Projects\Cellar_Watchdog\Docs\Resistor\PYu-RC_Group_51_RoHS_L_12.pdf; ComponentLink1Description: Datasheet; Supplier 2: Mouser; Supplier Part Number 2: 603-RC0603FR-078K2L; Supplier Part Number 1: 311-8.20KHRCT-ND
R44 R45 = RES_2.2kR-100mW-1%_0603: 2.2 kOhms ±1% 0.1W, 1/10W Chip Resistor 0603 (1608 Metric) Moisture Resistant Thick Film; Manufacturer: Yageo; Manufacturer Part Number: RC0603FR-072K2L; Temperature Coefficient: 100ppm/°C; Power Rating: 100mW; Voltage Rating: 50V; Supplier 1: Digi-Key; RoHS: Yes; Category: Chip SMD Resistors; Stock 1: 2856981; Pricing 1: 1=0.10000, 10=0.02100, 100=0.00850, 1000=0.00383, 2500=0.00332 (USD); Case/Package: 0603; Case Code (Imperial): 0603; Case Code (Metric): 1608; Min Operating Temperature: -55°C; Max Operating Temperature: 155°C; Resistance: 2.2kR; Tolerance: 1%; Packaging: Tape and Reel; Resistor Type: Thick Film; Package Quantity: 1; Termination: SMD/SMT; Number of Terminations: 2; Max Power Dissipation: 100mW; Features: Moisture Resistant; Series: RC; Resistance Tolerance: 1%; Construction: Rectangular; Length: 1.6mm; Width: 0.031inch; Height: 0.022inch; Depth: 0.8mm; Lead Free: Lead Free; Military Standard: Not; RoHS Compliant: Yes; Supplier 2: Mouser; ComponentLink1Description: Datasheet; ComponentLink1URL: C:\Users\Public\Documents\Altium\Projects\Cellar_Watchdog\Docs\Resistor\PYu-RC_Group_51_RoHS_L_12.pdf; Supplier Part Number 2: 603-RC0603FR-072K2L; Supplier Part Number 1: 311-2.20KHRCT-ND
TP62-TP65 = Test Point: PCB Test Point; ClassName: Test Point
  TP62: Value: LIGHT_SCL
  TP63: Value: LIGHT_SDA
  TP64: Value: LIGHT_INT
  TP65: Value: CATHODE
U6 = IC_VCNL4040M3OE: Optical Sensor Ambient 550nm I²C 8-SMD Module; Manufacturer: Vishay Semiconductors; Sensing Distance: 200mm; Min Supply Voltage (DC): 2.5V; Max Supply Voltage (DC): 3.6V; Output Current: 200mA; Output Type: I2C,Digital; Supplier 1: Digi-Key; Manufacturer Part Number: VCNL4040M3OE; RoHS: Yes; Category: Optical Sensors; Stock 1: 96939; Pricing 1: 1=2.91000, 5=2.75200, 10=2.36000, 25=1.88760, 50=1.73040, 100=1.57300, 500=1.37638, 1000=1.21908 (USD); Mount: Surface Mount; Case/Package: SMD/SMT; Number of Pins: 8; Min Operating Temperature: -40°C; Max Operating Temperature: 85°C; Packaging: Cut Tape; Wavelength: 550nm; Series: Filtron™; RoHS Compliant: Yes; Lead Free: Lead Free; ComponentLink2URL: C:\Users\Public\Documents\Altium\Projects\Cellar_Watchdog\Docs\Sensor\vcnl4040.pdf; ComponentLink2Description: Datasheet; Supplier 2: Mouser; Supplier Part Number 2: 78-VCNL4040M3OE; Supplier Part Number 1: VCNL4040M3OECT-ND

## Sheet Temp and Humidity Sensor.SchDoc: Temperature & Humidity Sensor
size A4; Date: Dec. 27th, 2022; Author: Karl Asseily; DrawnBy: Karl Asseily; DocumentNumber: 202301140903; Revision: 1.2; SheetNumber: 20; SheetTotal: 20
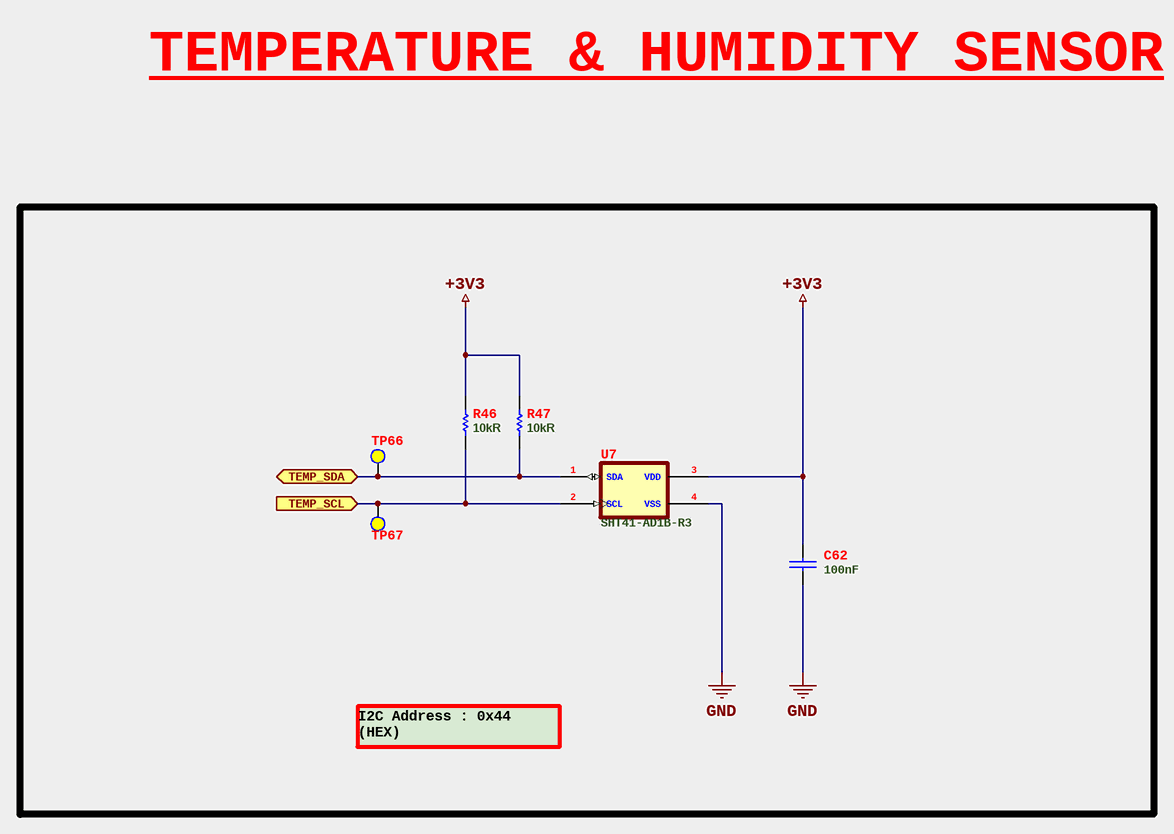
[diagram p17: Temp and Humidity Sensor.SchDoc]

### Parts
C62  100nF  [CAP_0603]
R46  10kR  [RES_0603]
R47  10kR  [RES_0603]
TP66  TEMP_SDA  [TEST POINT HOLE]  (value not drawn)  (no BOM)
TP67  TEMP_SCL  [TEST POINT HOLE]  (value not drawn)  (no BOM)
U7  SHT41-AD1B-R3  [IC_SENSIRION_SHT41-AD1B-R3]

### Ports
TEMP_SCL (in, see Cellar Watchdog, ESP32 Processor, Main Controller Unit), TEMP_SDA (bidir, see Cellar Watchdog, ESP32 Processor, Main Controller Unit)

### Nets
+3V3: C62.1 R46.2 R47.2 U7.3(VDD)
GND: C62.2 U7.4(VSS)
TEMP_SCL: R46.1 TP67.TP U7.2(SCL) ; port TEMP_SCL
TEMP_SDA: R47.1 TP66.TP U7.1(SDA) ; port TEMP_SDA

### Notes on the sheet
- TEMPERATURE & HUMIDITY SENSOR
- I2C Address : 0x44 (HEX)
  0100 0100
- Project
- Sheet
- Size
- Filename
- A4
- of
- Number
- Drawn By
- Rev.
- Variant
- Date

### Library data of the parts
C62 = CAP_0.1uF-50V-10%_0603: as C55-C59 on sheet LCD Display; Supplier 1: Digi-Key; RoHS: Yes; Category: Ceramic Capacitors; Stock 1: 10054527; Pricing 1: 1=0.10000, 10=0.05400, 50=0.02960, 100=0.02430, 500=0.01732, 1000=0.01361 (USD); Mounting Technology: Surface Mount; Case/Package: 0603; Pins: 2; Case Code (Metric): 1608; Case Code (Imperial): 0603; Dielectric Material: Ceramic; Min Operating Temperature: -55°C; Max Operating Temperature: 125°C; Package Quantity: 1; Capacitance: 100nF; Voltage Rating: 50V; Tolerance: 10%; Packaging: Tape and Reel; Dielectric: X7R; Termination: SMD/SMT; Voltage: 50V; Series: CC; Length: 0.063inch; Width: 0.031inch; Height: 0.8mm; Thickness: 0.035inch; Depth: 0.8mm; Radiation Hardening: No; Reach SVHC Compliant: Yes; Lead Free: Lead Free; Halogen Free: Halogen Free; RoHS Compliant: Yes; ComponentLink1URL: C:\Users\Public\Documents\Altium\Projects\Cellar_Watchdog\Docs\Capacitor\UPY-GPHC_X7R_6.3V-to-250V_22.pdf; ComponentLink1Description: Datasheet; Supplier Part Number 2: 603-CC603KRX7R9BB104; Supplier Part Number 1: 311-1344-1-ND; Supplier 2: Mouser
R46 R47 = RES_10kR-100mW-1%_0603: 10 kOhms ±1% 0.1W, 1/10W Chip Resistor 0603 (1608 Metric) Moisture Resistant Thick Film; Manufacturer: Yageo; Manufacturer Part Number: RC0603FR-0710KL; Temperature Coefficient: 100ppm/°C; Voltage Rating (DC): 50V; Power Rating: 100mW; Voltage Rating: 75V; Supplier 1: Digi-Key; RoHS: Yes; Category: Chip SMD Resistors; Stock 1: 43209622; Pricing 1: 1=0.10000, 10=0.02100, 100=0.00850, 1000=0.00383, 2500=0.00332 (USD); Case/Package: 0603; Pins: 2; Case Code (Imperial): 0603; Case Code (Metric): 1608; Weight: 7.1E-05oz; Min Operating Temperature: -55°C; Max Operating Temperature: 155°C; Tolerance: 1%; Resistor Type: Thick Film; Resistance: 10kR; Packaging: Tape and Reel; Termination: SMD/SMT; Features: Moisture Resistant; Series: RC; Max Power Dissipation: 100mW; Number of Terminations: 2; Resistance Tolerance: 1%; Construction: Rectangular; Length: 1.6mm; Width: 0.8mm; Height: 0.45mm; Depth: 0.8mm; Lead Pitch: 0.3mm; Reach SVHC Compliant: Yes; Lead Free: Lead Free; Military Standard: Not; RoHS Compliant: Yes; ComponentLink6URL: C:\Users\Public\Documents\Altium\Projects\Cellar_Watchdog\Docs\Resistor\PYu-RC_Group_51_RoHS_L_12.pdf; ComponentLink6Description: Datasheet; Supplier 2: Mouser; Supplier Part Number 1: 311-10.0KHRCT-ND; Supplier Part Number 2: 603-RC0603FR-0710KL
TP66 TP67 = Test Point: PCB Test Point; ClassName: Test Point
  TP66: Value: TEMP_SDA
  TP67: Value: TEMP_SCL
U7 = IC_SHT41-AD1B-R3: Humidity, Temperature 0 ~ 100% RH I²C ±1.8% RH 4 s Surface Mount; Manufacturer: Sensirion; Supplier 1: Digi-Key; Manufacturer Part Number: SHT41-AD1B-R3; RoHS: Yes; Stock 1: 9992; Pricing 1: 1=3.67000, 5=3.24000, 10=2.86200, 25=2.32200, 50=2.05200, 100=1.99800, 500=1.67400, 1000=1.56600, 5000=1.45800 (USD); Supplier Part Number 1: 1649-SHT41-AD1B-R3CT-ND; ComponentLink1Description: Datasheet; ComponentLink1URL: C:\Users\Public\Documents\Altium\Projects\Cellar_Watchdog\Docs\Sensor\Datasheet_SHT4xA.pdf